# Altium schematic sheet Main.SchDoc
size A4; SheetNumber: 1; SheetTotal: 4
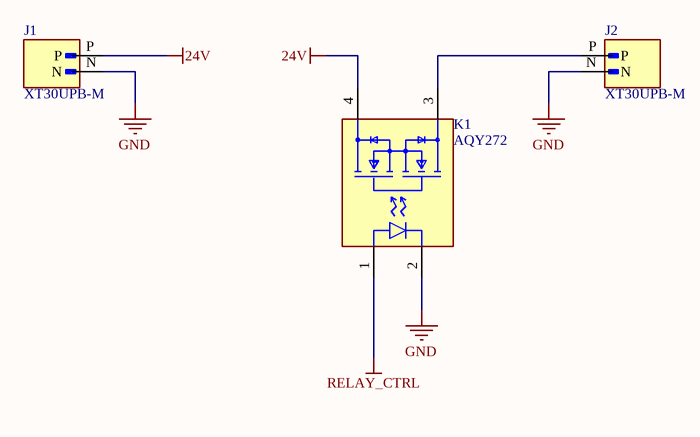
[diagram p0: Main.SchDoc]

## Parts
J1  XT30UPB-M  [AMASS_XT30UPB-M]
J2  XT30UPB-M  [AMASS_XT30UPB-M]
K1  AQY272  [FP-AQY272-MFG]

## Nets
24V: J1.P K1.4(2_DRAIN)
GND: J1.N J2.N K1.2(C)
RELAY_CTRL: K1.1(A)
NetJ2_P: J2.P K1.3(1_DRAIN)

## Library data of the parts
J1 J2 = XT30UPB-M: Socket; DC supply; XT30; male; PIN: 2; on PCBs; THT; yellow; 15A; 500V; MF: amass; SnapEDA_Link: https://www.snapeda.com/parts/XT30UPB-M/AMASS/view-part/?ref=snap; Package: None; Value: *; MP: XT30UPB-M; Check_prices: https://www.snapeda.com/parts/XT30UPB-M/AMASS/view-part/?ref=eda
K1 = CMP-05609-000164-1: SSR RELAY SPST-NO 2A 0-60V; Max Output Voltage: 60V; Test Voltage: 2.5kV; Forward Current: 50mA; Approvals: cULus; Capacitance: 1.5pF; On-State Resistance: 180mR; Throw Configuration: SPST; Contact Resistance: 110mR; Max Input Voltage: 1.5V; Relay Type: Relay; Min Operating Temperature: -40°C; Max Operating Temperature: 85°C; Output Current: 2A; RoHS Compliant: Yes; REACH SVHC: No SVHC; Radiation Hardening: No; Mount: Through Hole; Max Input Current: 50mA; Max Output Current: 2A; Isolation Voltage: 2.5kV; Packaging: Rail/Tube; Input Current: 50mA; Lead Free: Lead Free; Output Voltage: 60V; Number of Pins: 4; Package Quantity: 50; Case/Package: DIP; Current Rating: 2A; Voltage Rating (AC): 60V; Load Current: 2A; Termination: PC Pin